# Altium schematic sheet rigidPCB2_rev.SchDoc
size A3; SheetNumber: 2; SheetTotal: 2
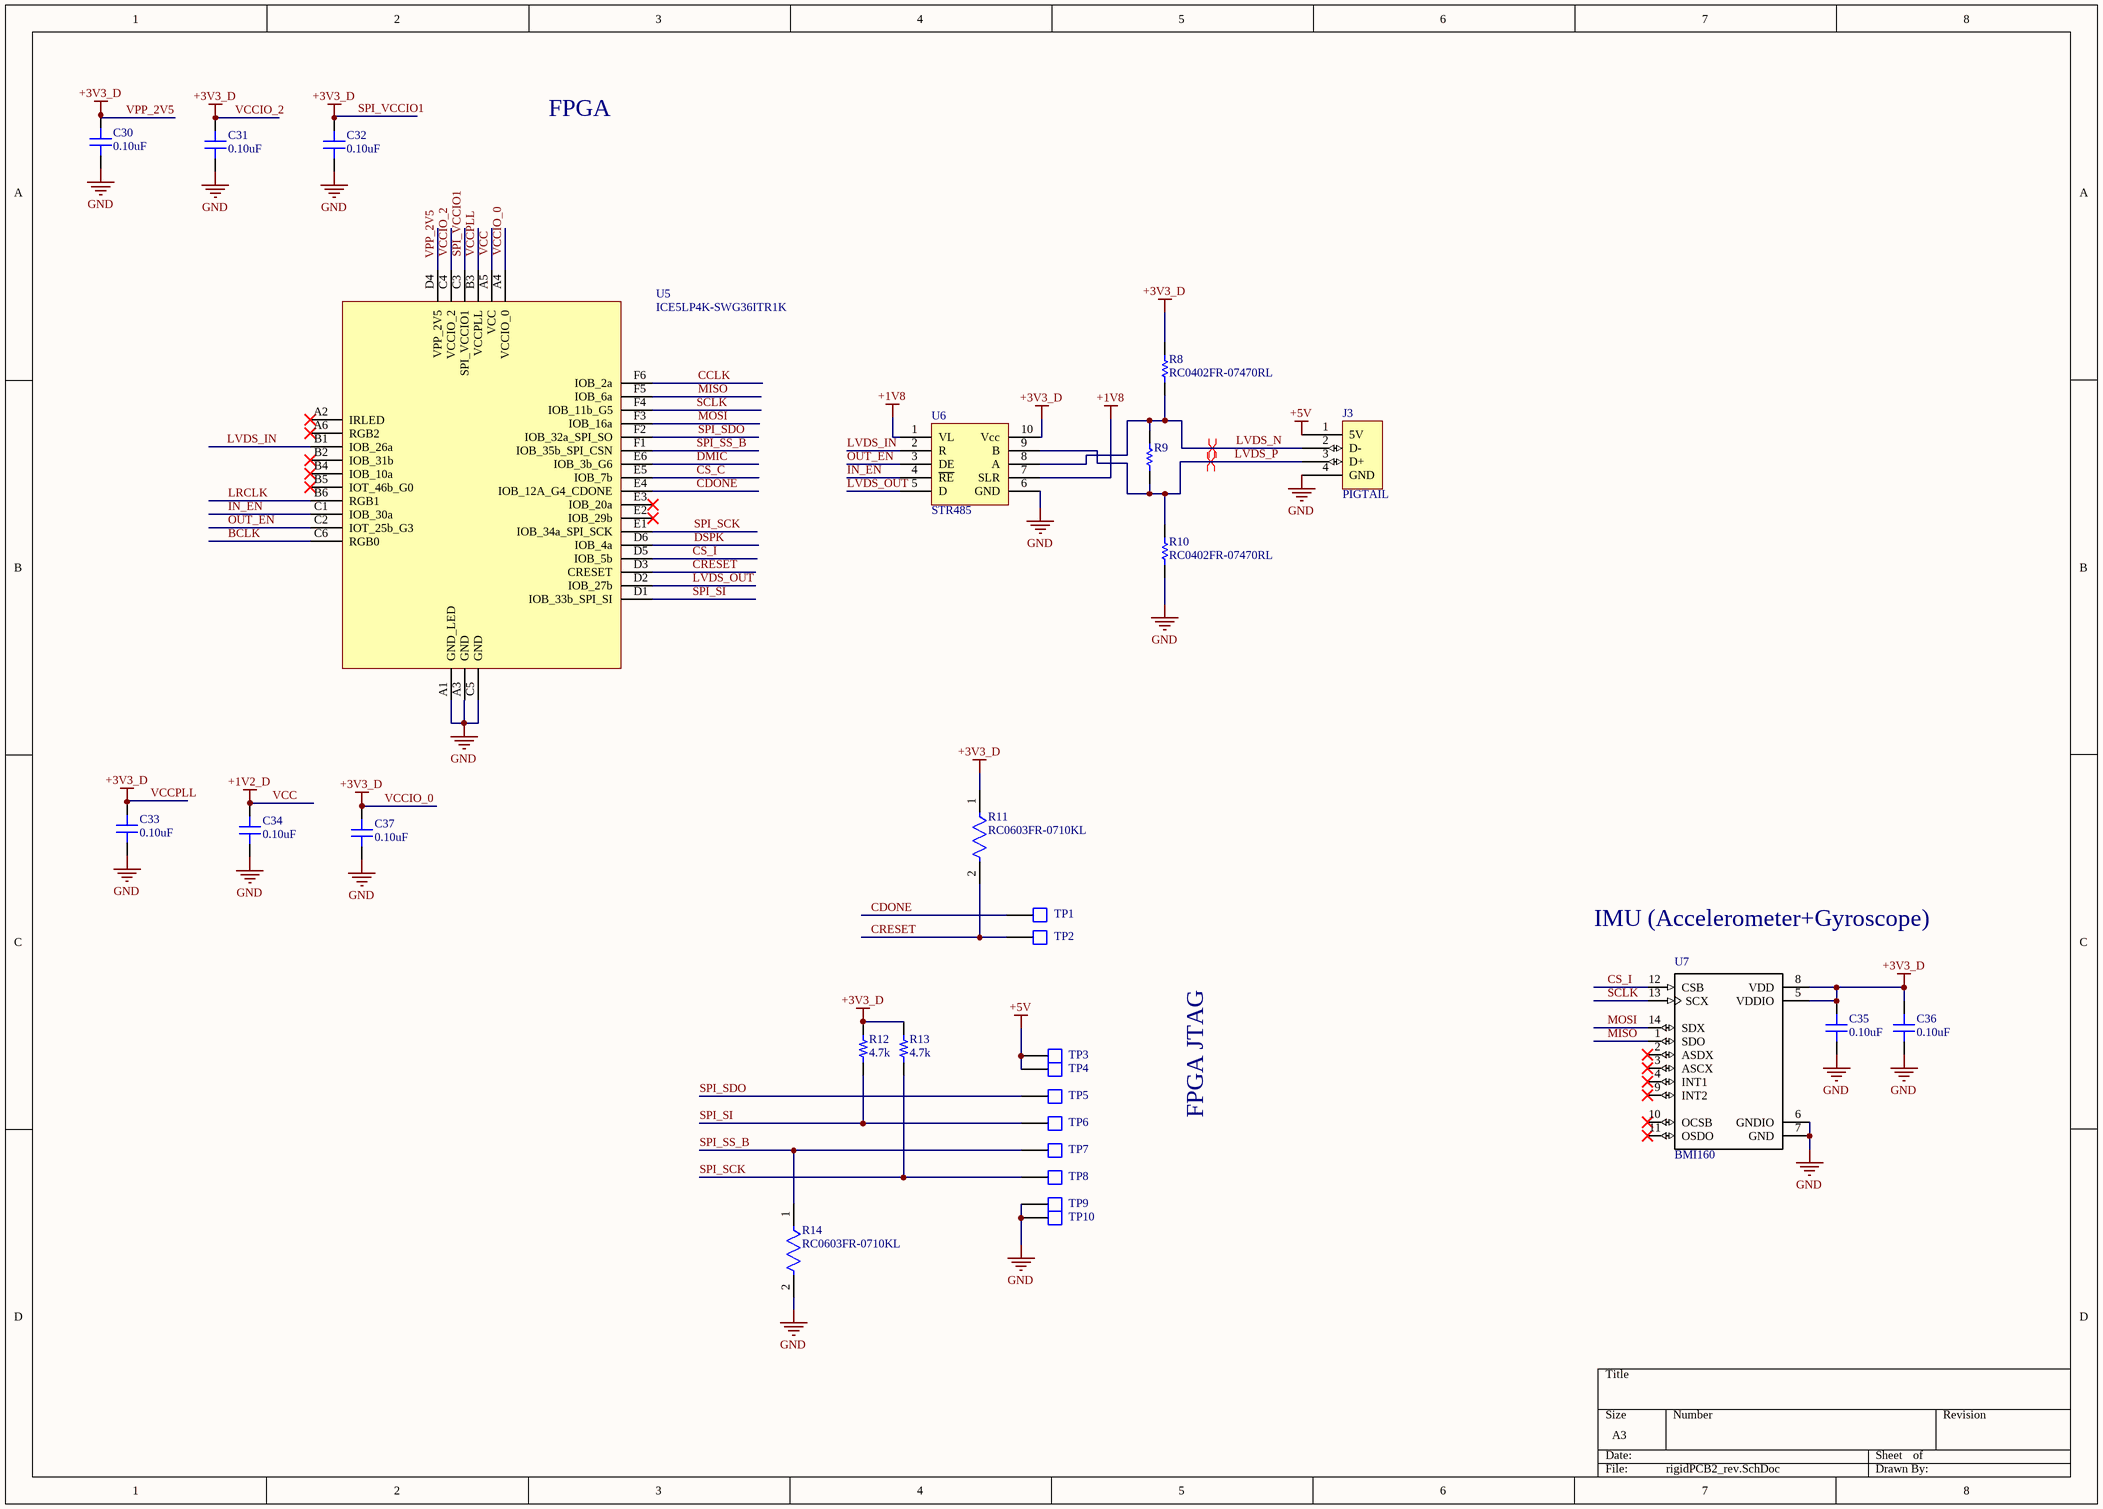
[diagram p0: rigidPCB2_rev.SchDoc]

## Parts
C30  0.10uF  [CAP 0201/0603]
C31  0.10uF  [CAP 0201/0603]
C32  0.10uF  [CAP 0201/0603]
C33  0.10uF  [CAP 0201/0603]
C34  0.10uF  [CAP 0201/0603]
C35  0.10uF  [CAP 0201/0603]
C36  0.10uF  [CAP 0201/0603]
C37  0.10uF  [CAP 0201/0603]
J3  PIGTAIL  [PIGTAIL]
R8  RC0402FR-07470RL  [RESC1005X40X25ML05T10]
R9  RC0402FR-0745R3L  [RESC1005X40X25ML05T10]  (value not drawn)
R10  RC0402FR-07470RL  [RESC1005X40X25ML05T10]
R11  RC0603FR-0710KL  [FP-RC0603-0_55-IPC_C]
R12  4.7k  [RES 0201/0603]
R13  4.7k  [RES 0201/0603]
R14  RC0603FR-0710KL  [FP-RC0603-0_55-IPC_C]
TP1  TP_SMD_DJB  [TP_SMD_DJB]  (value not drawn)
TP2  TP_SMD_DJB  [TP_SMD_DJB]  (value not drawn)
TP3  TP_SMD_DJB  [TP_SMD_DJB]  (value not drawn)
TP4  TP_SMD_DJB  [TP_SMD_DJB]  (value not drawn)
TP5  TP_SMD_DJB  [TP_SMD_DJB]  (value not drawn)
TP6  TP_SMD_DJB  [TP_SMD_DJB]  (value not drawn)
TP7  TP_SMD_DJB  [TP_SMD_DJB]  (value not drawn)
TP8  TP_SMD_DJB  [TP_SMD_DJB]  (value not drawn)
TP9  TP_SMD_DJB  [TP_SMD_DJB]  (value not drawn)
TP10  TP_SMD_DJB  [TP_SMD_DJB]  (value not drawn)
U5  ICE5LP4K-SWG36ITR1K  [36-XFBGA]
U6  STR485  [STR485LVQT]
U7  BMI160  [LGA14R50P5X4_300X250X83]

## Nets
+1V8: U6.1(VL) U6.7(SLR)
+5V: J3.1(5V) TP3.1 TP4.1
GND: C30.1 C31.1 C32.1 C33.1 C34.1 C35.1 C36.1 C37.1 J3.4(GND) R10.1 R14.2 TP9.1 TP10.1 U5.A1(GND_LED) U5.A3(GND) U5.C5(GND) U6.6(GND) U7.6(GNDIO) U7.7(GND)
SPI_VCCIO1: C30.2 C31.2 C32.2 C33.2 C35.2 C36.2 C37.2 R8.2 R11.1 R12.2 R13.2 U5.A4(VCCIO_0) U5.B3(VCCPLL) U5.C3(SPI_VCCIO1) U5.C4(VCCIO_2) U5.D4(VPP_2V5) U6.10(Vcc) U7.5(VDDIO) U7.8(VDD)  [also labelled +3V3_D, VCCIO_0, VCCIO_2, VCCPLL, VPP_2V5]
VCC: C34.2 U5.A5(VCC)  [also labelled +1V2_D]
BCLK: U5.C6(RGB0)
CCLK: U5.F6(IOB_2a)
CDONE: TP1.1 U5.E4(IOB_12A_G4_CDONE)
CRESET: R11.2 TP2.1 U5.D3(CRESET)
CS_C: U5.E5(IOB_7b)
CS_I: U5.D5(IOB_5b) U7.12(CSB)
DMIC: U5.E6(IOB_3b_G6)
DSPK: U5.D6(IOB_4a)
IN_EN: U5.C1(IOB_30a) U6.4(~{RE})
LRCLK: U5.B6(RGB1)
LVDS_IN: U5.B1(IOB_26a) U6.2(R)
LVDS_N: J3.2(D-) R8.1 R9.2 U6.8(A)
LVDS_OUT: U5.D2(IOB_27b) U6.5(D)
LVDS_P: J3.3(D+) R9.1 R10.2 U6.9(B)
MISO: U5.F5(IOB_6a) U7.1(SDO)
MOSI: U5.F3(IOB_16a) U7.14(SDX)
OUT_EN: U5.C2(IOT_25b_G3) U6.3(DE)
SCLK: U5.F4(IOB_11b_G5) U7.13(SCX)
SPI_SCK: R13.1 TP8.1 U5.E1(IOB_34a_SPI_SCK)
SPI_SDO: TP5.1 U5.F2(IOB_32a_SPI_SO)
SPI_SI: R12.1 TP6.1 U5.D1(IOB_33b_SPI_SI)
SPI_SS_B: R14.1 TP7.1 U5.F1(IOB_35b_SPI_CSN)

Not connected (* = marked no-connect by the designer): U5 A2(IRLED)* A6(RGB2)* B2(IOB_31b)* B4(IOB_10a)* B5(IOT_46b_G0)* E2(IOB_29b)* E3(IOB_20a)*; U7 2(ASDX)* 3(ASCX)* 4(INT1)* 9(INT2)* 10(OCSB)* 11(OSDO)*

## Layout directives
differential pair: LVDS_N, LVDS_P

## Notes on the sheet
- FPGA
- IMU (Accelerometer+Gyroscope)
- FPGA JTAG

## Library data of the parts
C30-C37 = CL03A104KP3NNNC: CAP CER 0.1UF 10V X5R 0201; Manufacturer: Samsung Electro-Mechanics America, Inc.; TemperatureRange: -55C ~ 85C; Tolerance: 10%; Value: 0.10uF; Part Number: CL03A104KP3NNNC; PartId: 20562; Supplier 1: Digi-Key; Supplier Part Number 1: 1276-1115-2-ND; ComponentLink1Description: Datasheet; ComponentLink1URL: http://www.samsungsem.com/kr/support/product-search/mlcc/__icsFiles/afieldfile/2016/08/18/S_CL03A104KP3NNND.pdf; ComponentLink2Description: Digi-Key Listing; ComponentLink2URL: https://www.digikey.com/product-detail/en/samsung-electro-mechanics-america-inc/CL03A104KP3NNNC/1276-1115-2-ND/3886773; TemperatureCoefficient: X5R; Voltage: 10V; Price: 0.0031; Device Package: 0201 (0603 Metric)
R8 R10 = CMP-2002-07697-1: Manufacturer: Yageo / Phycomp; Part Number: RC0402FR-07470RL
R9 = CMP-2002-07109-1: Manufacturer: Yageo / Phycomp; Part Number: RC0402FR-0745R3L
R11 R14 = CMP-2100-03664-2: RES 10K OHM 1% 1/10W 0603; Voltage Rating: 75V; Voltage Rating (DC): 50V; Resistance: 10kR; Power Rating: 100mW; Temperature Coefficient: 100ppm/°C; Depth: 0.8mm; Termination: SMD/SMT; Resistor Type: Thick Film; Series: RC; Construction: Rectangular; Features: Moisture Resistant; Packaging: Tape and Reel; Min Operating Temperature: -55°C; Number of Terminations: 2; Lead Pitch: 0.3mm; RoHS Compliant: Yes; Case/Package: 0603; Resistance Tolerance: 1%; Military Standard: Not; Weight: 7.1E-05oz; Number of Pins: 2; Tolerance: 1%; Length: 1.6mm; Case Code (Imperial): 0603; Lead Free: Lead Free; Width: 0.8mm; Max Power Dissipation: 100mW; Height: 0.45mm; Max Operating Temperature: 155°C; Case Code (Metric): 1608; Size Code: 0603
R12 R13 = RC0201FR-074K7L: RES SMD 4.7K OHM 1% 1/20W 0201; Manufacturer: Yageo; TemperatureRange: -55C ~ 125C; TemperatureCoefficient: 200ppm/C; PowerRating: 0.05W, 1/20W; Value: 4.7k; Part Number: RC0201FR-074K7L; PartId: 19526; Supplier 1: Digi-Key; Supplier Part Number 1: 311-4.70KMTR-ND; ComponentLink1Description: Datasheet; ComponentLink1URL: http://www.yageo.com/documents/recent/PYu-RC_Group_51_RoHS_L_04.pdf; ComponentLink2Description: Digi-Key Listing; ComponentLink2URL: https://www.digikey.com/product-detail/en/yageo/RC0201FR-074K7L/311-4.70KMTR-ND/1948894; Tolerance: 1%; Price: 0.0056; Device Package: 0201 (0603 Metric)
TP1-TP10 = TP_SMD_DJB: Digital Jellybean Style SMD Test Point; DNP: DNP
U5 = ICE5LP4K-SWG36ITR1K: Field Programmable Gate Array (FPGA) IC 25 65536 1280 36-VFBGA; Supplier 1: Digi-Key
U6 = STR485: 3.3 V LVDS RS485 compatible with 1.8 V I/Os and selectable speed
U7 = BMI160_1: BMI160 2.5 x 3 mm Tiaxial Accelerometer / Gyroscope Inertial Measurement Unit; MF: Bosch; Availability: Good; Package: LGA-14 Bosch; Price: 3.29 USD; MP: BMI160; Value: *